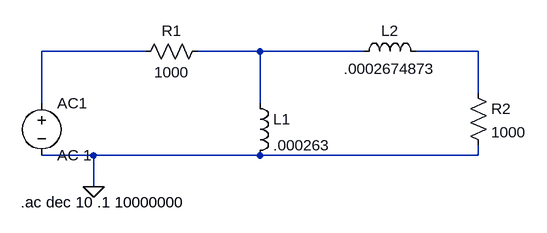
[diagram p0: schematic RL bandpass 1.asc]
RL bandpass 1.asc, the LTspice schematic file:
Version 4
SHEET 1 880 680
WIRE 128 0 -32 0
WIRE 304 0 208 0
WIRE 464 0 304 0
WIRE 640 0 544 0
WIRE 640 64 640 0
WIRE -32 80 -32 0
WIRE 304 80 304 0
WIRE 48 160 -32 160
WIRE 304 160 48 160
WIRE 640 160 640 144
WIRE 640 160 304 160
WIRE 48 208 48 160
FLAG 48 208 0
SYMBOL voltage -32 64 R0
SYMATTR InstName AC1
SYMATTR Value AC 1
SYMBOL res 224 -16 R90
WINDOW 0 0 56 VBottom 2
WINDOW 3 32 56 VTop 2
SYMATTR InstName R1
SYMATTR Value 1000
SYMBOL ind 288 64 R0
SYMATTR InstName L1
SYMATTR Value .000263
SYMBOL res 624 48 R0
SYMATTR InstName R2
SYMATTR Value 1000
SYMBOL ind 448 16 R270
WINDOW 0 32 56 VTop 2
WINDOW 3 5 56 VBottom 2
SYMATTR InstName L2
SYMATTR Value .0002674873
TEXT -64 232 Left 2 !.ac dec 10 .1 10000000

The netlist it stands for:
* RL bandpass 1.asc
V§AC1 N001 0 AC 1
R1 N002 N001 1000
L1 N002 0 .000263
R2 N003 0 1000
L2 N002 N003 .0002674873
.ac dec 10 .1 10000000
.backanno
.end